# EAGLE schematic VarioGPS_schematic (EAGLE 7.3.0)
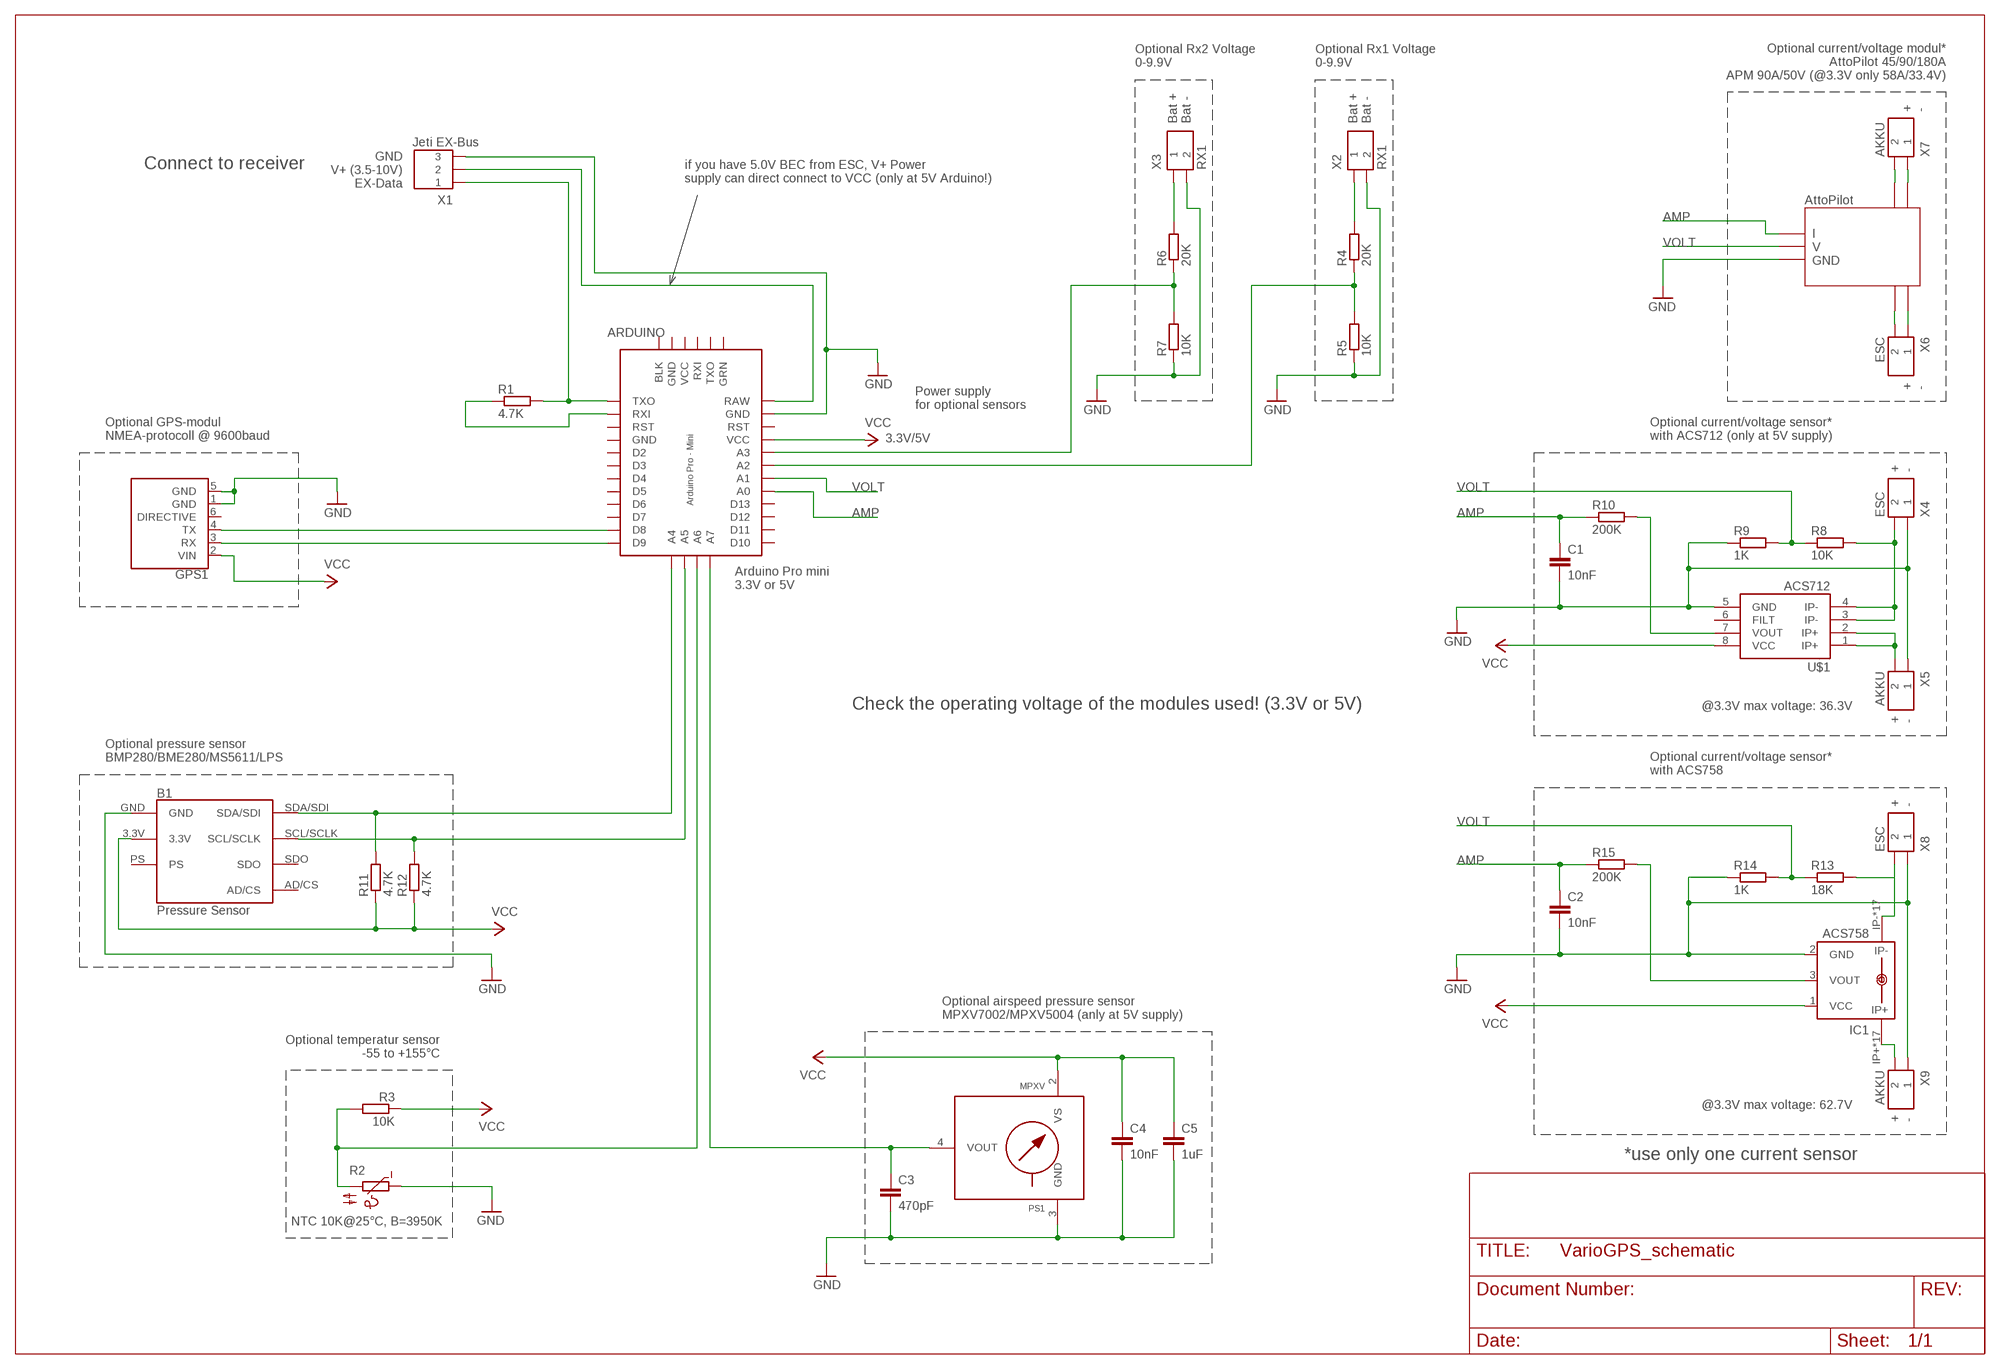
[diagram p0: schematic, sheet 1]

## Parts
ARDUINO  ARDUINO Pro Mini (3.3V or 5V)  PROMINI  [PROMINI]
B1  Pressure Sensor  SPARKFUN_MS5803-14BA_BREAKOUT  [SPARKFUN_MS5803-14BA_BREAKOUT]
C1  10nF  C2,5-3  [C2.5-3]
C2  10nF  C2,5-3  [C2.5-3]
C3  470pF  C2,5-3  [C2.5-3]
C4  10nF  C2,5-3  [C2.5-3]
C5  1uF  C2,5-3  [C2.5-3]
GPS1  EM-506-VERTICAL  [JST-6PIN-1MM]
IC1  ACS758  ACS758LCB-100B-PFF-T  [CB-PFF]
PS1  MPXV  MPX-1351  [1351]
R1  4.7K  R-EU_0207/10  [0207/10]
R2  NTC 10K@25°C, B=3950K  NTC640  [P640]
R3  10K  R-EU_0207/10  [0207/10]
R4  20K  R-EU_0207/10  [0207/10]
R5  10K  R-EU_0207/10  [0207/10]
R6  20K  R-EU_0207/10  [0207/10]
R7  10K  R-EU_0207/10  [0207/10]
R8  10K  R-EU_0207/10  [0207/10]
R9  1K  R-EU_0207/10  [0207/10]
R10  200K  R-EU_0207/10  [0207/10]
R11  4.7K  R-EU_0207/10  [0207/10]
R12  4.7K  R-EU_0207/10  [0207/10]
R13  18K  R-EU_0207/10  [0207/10]
R14  1K  R-EU_0207/10  [0207/10]
R15  200K  R-EU_0207/10  [0207/10]
U$1  ACS712  [SO08]
X1  Jeti EX-Bus  EZG-00-303  [EZG-00-303]
X2  RX1  EZG-00-302  [EZG-00-302]
X3  RX1  EZG-00-302  [EZG-00-302]
X4  ESC  EZG-00-302  [EZG-00-302]
X5  AKKU  EZG-00-302  [EZG-00-302]
X6  ESC  EZG-00-302  [EZG-00-302]
X7  AKKU  EZG-00-302  [EZG-00-302]
X8  ESC  EZG-00-302  [EZG-00-302]
X9  AKKU  EZG-00-302  [EZG-00-302]

## Nets
AMP: ARDUINO.A0 C1.1 C2.1 R10.1 R15.1
GND: ARDUINO.GND@1(GND) B1.GND C1.2 C2.2 C3.2 C4.2 C5.2 GPS1.1(GND) GPS1.5(GND) IC1.2(GND) PS1.3(GND) R2.1 R5.1 R7.1 R9.1 R14.1 U$1.5(GND) X1.3 X2.2 X3.2 X4.1 X5.1 X8.1 X9.1
N$1: ARDUINO.TXO@0(TXO) R1.2 X1.1
N$2: ARDUINO.RAW X1.2
N$3: ARDUINO.A5 B1.SCL/SCLK R12.2
N$4: ARDUINO.RXI@0(RXI) R1.1
N$5: ARDUINO.A6 R2.2 R3.2
N$6: ARDUINO.D8 GPS1.4(TX)
N$7: ARDUINO.D9 GPS1.3(RX)
N$8: ARDUINO.A4 B1.SDA/SDI R11.2
N$9: R4.2 X2.1
N$10: ARDUINO.A2 R4.1 R5.2
N$11: U$1.1(IP+) U$1.2(IP+) X5.2
N$12: R6.2 X3.1
N$13: ARDUINO.A3 R6.1 R7.2
N$14: R8.2 U$1.3(IP-) U$1.4(IP-) X4.2
N$15: R10.2 U$1.7(VOUT)
N$17: X7.1
N$18: X7.2
N$20: X6.1
N$21: X6.2
N$22: IC1.IP+ IC1.IP+@2(IP+) IC1.IP+@3(IP+) IC1.IP+@4(IP+) IC1.IP+@5(IP+) IC1.IP+@6(IP+) IC1.IP+@7(IP+) IC1.IP+@8(IP+) IC1.IP+@9(IP+) IC1.IP+@10(IP+) IC1.IP+@11(IP+) IC1.IP+@12(IP+) IC1.IP+@13(IP+) IC1.IP+@14(IP+) IC1.IP+@15(IP+) IC1.IP+@16(IP+) IC1.IP+@17(IP+) X9.2
N$23: IC1.IP- IC1.IP-@2(IP-) IC1.IP-@3(IP-) IC1.IP-@4(IP-) IC1.IP-@5(IP-) IC1.IP-@6(IP-) IC1.IP-@7(IP-) IC1.IP-@8(IP-) IC1.IP-@9(IP-) IC1.IP-@10(IP-) IC1.IP-@11(IP-) IC1.IP-@12(IP-) IC1.IP-@13(IP-) IC1.IP-@14(IP-) IC1.IP-@15(IP-) IC1.IP-@16(IP-) IC1.IP-@17(IP-) R13.2 X8.2
N$25: ARDUINO.A7 C3.1 PS1.4(VOUT)
N$26: IC1.3(VOUT) R15.2
VCC: ARDUINO.VCC@0(VCC) B1.3.3V C4.1 C5.1 GPS1.2(VIN) IC1.1(VCC) PS1.2(VS) R3.1 R11.1 R12.1 U$1.8(VCC)
VOLT: ARDUINO.A1 R8.1 R9.2 R13.1 R14.2
Unconnected: ARDUINO.BLK ARDUINO.D2 ARDUINO.D3 ARDUINO.D4 ARDUINO.D5 ARDUINO.D6 ARDUINO.D7 ARDUINO.D10 ARDUINO.D11 ARDUINO.D12 ARDUINO.D13 ARDUINO.GRN ARDUINO.RST@0(RST) ARDUINO.RTS@1(RST) ARDUINO.RXI@1(RXI) ARDUINO.TXO@1(TXO) B1.AD/CS B1.PS B1.SDO GPS1.6(DIRECTIVE) PS1.1(NC) PS1.5(NC) PS1.6(NC) U$1.6(FILT)

## Notes on the sheet
- Optional Rx2 Voltage
  0-9.9V
- Optional Rx1 Voltage
  0-9.9V
- Optional current/voltage modul*
  AttoPilot 45/90/180A
  APM 90A/50V (@3.3V only 58A/33.4V)
- +
  -
- Bat +
  Bat -
- Bat +
  Bat -
- Connect to receiver
- if you have 5.0V BEC from ESC, V+ Power 
  supply can direct connect to VCC (only at 5V Arduino!)
- GND
  V+ (3.5-10V)
  EX-Data
- AttoPilot
- I
  V
  GND
- +
  -
- Power supply
  for optional sensors
- Optional GPS-modul
  NMEA-protocoll @ 9600baud
- Optional current/voltage sensor*
  with ACS712 (only at 5V supply)
- 3.3V/5V
- +
  -
- Arduino Pro mini
  3.3V or 5V
- Check the operating voltage of the modules used! (3.3V or 5V) | @3.3V max voltage: 36.3V
- +
  -
- Optional pressure sensor
  BMP280/BME280/MS5611/LPS
- Optional current/voltage sensor*
  with ACS758
- +
  -
- Optional airspeed pressure sensor
  MPXV7002/MPXV5004 (anly at 5V supply)
- Optional temperatur sensor
  -55 to +155°C
- @3.3V max voltage: 62.7V
- +
  -
- *use only one current sensor

## Power pins joined to a net without a drawn wire
GND: ARDUINO.GND@0(GND) ARDUINO.GND@2(GND)
VCC: ARDUINO.VCC@1(VCC)

## Library data of the parts
ARDUINO = arduino:PROMINI: Arduino Pro - Mini compatible device Reference: https://www.arduino.cc/en/Main/ArduinoBoardProMini; MF: ARDUINO; MPN: MINI
B1 = SparkFun-Boards:SPARKFUN_MS5803-14BA_BREAKOUT: SparkFun MSP5803-14BA Breakout I2C compatible pressure sensor breakout SparkFun Products: SparkFun MSP5803-14BA Breakout <https://www.sparkfun.com/products/12909>; SF_ID: SEN-12909
C1-C5 = capacitor-wima:C: CAPACITOR naming: grid - package width
GPS1 = SparkFun-GPS:EM-506: USGlobalSat EM-506 High Performance GPS Module EM-506 GPS module features high sensitivity, low power and ultra small form factor. This GPS module is powered by SiRF Star IV, it can provide you with superior sensitivity and performance even in urban canyon and dense foliage environment. With SiRF CGEE (Client Generated Extended Ephemeris) technology, it predicts satellite positions for up to 3 days and delivers CGEE-start time of less than 15 seconds under most conditions, without any network assistance. Besides, MicroPower Mode allows GPS module to stay in a hot-start condition nearly continuously while consuming very little power. SparkFun Products GPS Receiver - EM-506 (48 Channel) <https://www.sparkfun.com/products/12751> (GPS-12751); PROD_ID: CONN-08249
IC1 = allegro:ACS758*: Thermally Enhanced, Fully Integrated, Hall Effect-Based Linear Current Sensor with 100 micro Ohm Current Conductor display layer 49 Reference in BRD and place VIAs on circles Source: http://www.allegromicro.com/en/Products/Part_Numbers/0758/0758.pdf; MPN: ACS758LCB-100B-PFF-T; OC_FARNELL: 1718998; OC_NEWARK: 04R7132
PS1 = mpx-freescale:MPX*****: Generic MPX pressure sensor
R1 R3-R15 = resistor:R-EU_: RESISTOR, European symbol
R2 = ptc-ntc:NTC640: PHILIPS NTC; OC_FARNELL: unknown; OC_NEWARK: unknown
U$1 = SparkFun-Sensors:ACS712: ACS712 Hall-effect-based isolated linear current sensor Datasheet <http://www.sparkfun.com/datasheets/BreakoutBoards/0712.pdf> SparkFun Products SparkFun Low Current Sensor Breakout - ACS712 <https://www.sparkfun.com/products/8883> (SEN-08883); PROD_ID: IC-08964
X1 = con-lemo:EZG-?-303: LEMO Connector Source: http://www.lemo.com/pdfs/catalog/ROW/German/unipole_multipole.pdf; OC_FARNELL: unknown; OC_NEWARK: unknown
X2-X9 = con-lemo:EZG-?-302: LEMO Connector Source: http://www.lemo.com/pdfs/catalog/ROW/German/unipole_multipole.pdf; OC_FARNELL: unknown; OC_NEWARK: unknown